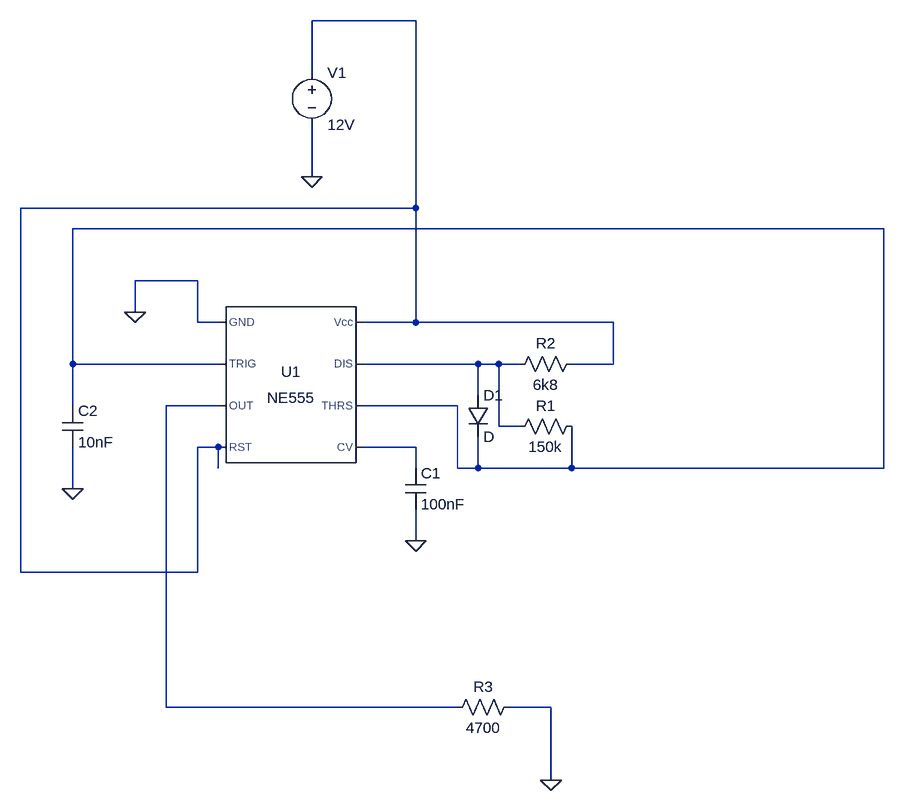
[diagram p0: schematic evse-LTSpice_simulation.asc]
evse-LTSpice_simulation.asc, the LTspice schematic file:
Version 4
SHEET 1 2256 840
WIRE 416 -368 256 -368
WIRE 256 -288 256 -368
WIRE 256 -128 256 -208
WIRE 416 -80 416 -368
WIRE 416 -80 -192 -80
WIRE 1136 -48 -112 -48
WIRE 80 32 -16 32
WIRE -16 80 -16 32
WIRE 80 96 80 32
WIRE 112 96 80 96
WIRE 416 96 416 -80
WIRE 416 96 336 96
WIRE 720 96 416 96
WIRE -112 160 -112 -48
WIRE 112 160 -112 160
WIRE 512 160 336 160
WIRE 544 160 512 160
WIRE 576 160 544 160
WIRE 720 160 720 96
WIRE 720 160 656 160
WIRE 512 208 512 160
WIRE -112 224 -112 160
WIRE 112 224 32 224
WIRE 480 224 336 224
WIRE 544 256 544 160
WIRE 576 256 544 256
WIRE 112 288 80 288
WIRE 416 288 336 288
WIRE 112 320 112 288
WIRE 416 320 416 288
WIRE 480 320 480 224
WIRE 512 320 512 272
WIRE 512 320 480 320
WIRE 656 320 656 256
WIRE 656 320 512 320
WIRE 1136 320 1136 -48
WIRE 1136 320 656 320
WIRE -112 352 -112 288
WIRE 416 432 416 384
WIRE -192 480 -192 -80
WIRE 80 480 80 288
WIRE 80 480 -192 480
WIRE 32 688 32 224
WIRE 480 688 32 688
WIRE 624 688 560 688
WIRE 624 800 624 688
FLAG -112 352 0
FLAG 416 432 0
FLAG -16 80 0
FLAG 256 -128 0
FLAG 624 800 0
SYMBOL Misc\\NE555 224 192 R0
SYMATTR InstName U1
SYMBOL cap 400 320 R0
SYMATTR InstName C1
SYMATTR Value 100nF
SYMATTR SpiceLine V=50V
SYMBOL res 560 272 R270
WINDOW 0 32 56 VTop 2
WINDOW 3 0 56 VBottom 2
SYMATTR InstName R1
SYMATTR Value 150k
SYMBOL res 672 144 R90
WINDOW 0 0 56 VBottom 2
WINDOW 3 32 56 VTop 2
SYMATTR InstName R2
SYMATTR Value 6k8
SYMBOL cap -128 224 R0
SYMATTR InstName C2
SYMATTR Value 10nF
SYMBOL voltage 256 -304 R0
WINDOW 123 0 0 Left 2
WINDOW 39 0 0 Left 2
SYMATTR InstName V1
SYMATTR Value 12V
SYMBOL res 576 672 R90
WINDOW 0 0 56 VBottom 2
WINDOW 3 32 56 VTop 2
SYMATTR InstName R3
SYMATTR Value 4700
SYMBOL diode 496 208 R0
SYMATTR InstName D1

The netlist it stands for:
* evse-LTSpice_simulation.asc
XU1 0 N002 N004 N001 N005 N002 N003 N001 NE555  ; pins GND TRIG OUT RST CV THRS DIS Vcc
C1 N005 0 100nF V=50V
R1 N003 N002 150k
R2 N001 N003 6k8
C2 N002 0 10nF
V1 N001 0 12V
R3 0 N004 4700
D1 N003 N002 D
.model D D
.lib standard.dio
.lib NE555.sub
.backanno
.end